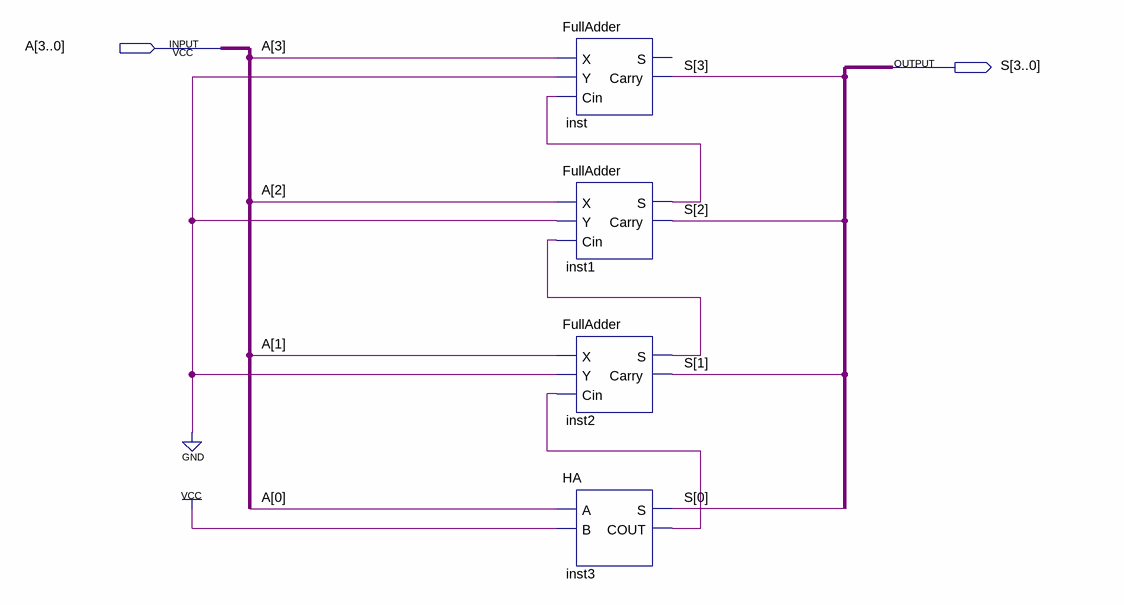
[diagram p0: schematic sheet]
// Quartus schematic CONGVAO1.bdf as structural Verilog: 4 symbols, 2 pins
module CONGVAO1 (
  input  [3:0] A,
  output [3:0] S
);

  wire inst1_s, inst2_s, inst3_cout;

  FullAdder inst (.X(A[3]), .Y(1'b0), .Cin(inst1_s), .Carry(S[3]));  // open: S
  FullAdder inst1 (.X(A[2]), .Y(1'b0), .Cin(inst2_s), .S(inst1_s), .Carry(S[2]));
  FullAdder inst2 (.X(A[1]), .Y(1'b0), .Cin(inst3_cout), .S(inst2_s), .Carry(S[1]));
  HA inst3 (.A(A[0]), .B(1'b1), .S(S[0]), .COUT(inst3_cout));
endmodule
